# Altium schematic sheet (10)-Motor Driver-2.SchDoc
size A; SheetNumber: 11; SheetTotal: 11
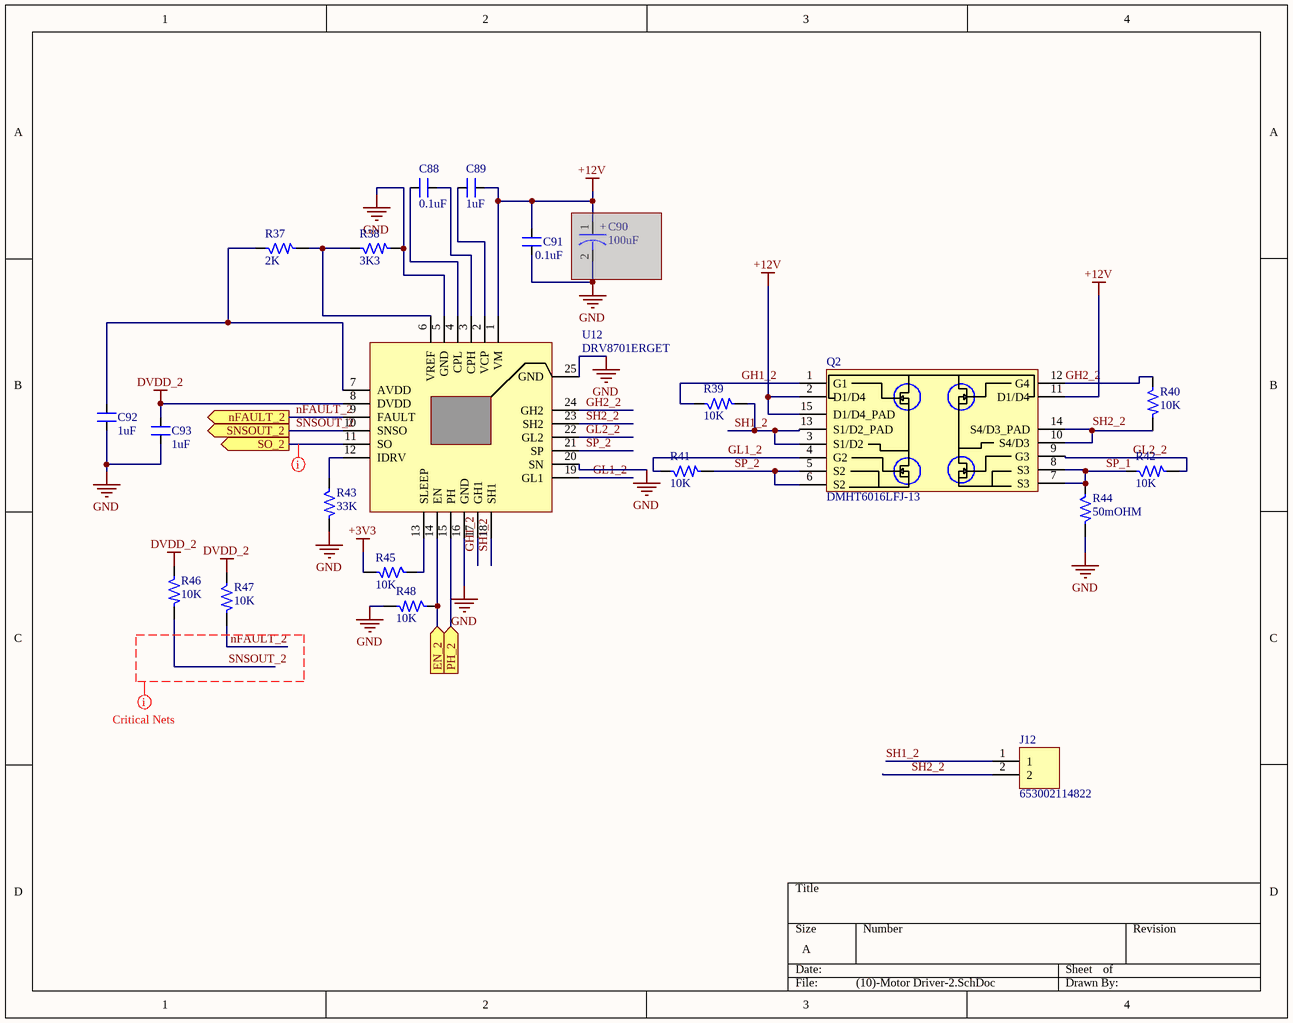
[diagram p0: (10)-Motor Driver-2.SchDoc]

## Parts
C88  0.1uF  [CAP_0805]
C89  1uF  [CAP_0805]
C90  100uF  [ACAP_P236_D305_H303_RAD]  (masked out: inside a compile mask, not in the netlist)
C91  0.1uF  [CAP_0805]
C92  1uF  [CAP_0805]
C93  1uF  [CAP_0805]
J12  653002114822  [CON2_50_653002114822_TH_ST]
Q2  DMHT6016LFJ-13  [DFN5045-12_33_212_27X15_SMD_1]
R37  2K  [RES_0603]
R38  3K3  [RES_0603]
R39  10K  [RES_0603]
R40  10K  [RES_0603]
R41  10K  [RES_0603]
R42  10K  [RES_0603]
R43  33K  [RES_0805]
R44  50mOHM  [RES_2512]
R45  10K  [RES_0603]
R46  10K  [RES_0603]
R47  10K  [RES_0603]
R48  10K  [RES_0603]
U12  DRV8701ERGET  [VFQFN24_19.6_196_12X32_SMD_1]

## Ports
EN_2 (in), nFAULT_2 (out), PH_2 (in), SNSOUT_2 (out), SO_2 (out)

## Nets
+3V3: R45.2
+12V: C89.2 C91.1 Q2.2(D1/D4) Q2.11(D1/D4) Q2.15(D1/D4_PAD) U12.1(VM)
DVDD_2: C93.1 R46.1 R47.1 U12.8(DVDD)
GND: C91.2 C92.2 C93.2 R38.2 R43.2 R44.2 R48.2 U12.5(GND) U12.16(GND) U12.20(SN) U12.25(GND)
EN_2: R48.1 U12.14(EN) ; port EN_2
GH1_2: Q2.1(G1) R39.1 U12.17(GH1)
GH2_2: Q2.12(G4) R40.1 U12.24(GH2)
GL1_2: Q2.4(G2) R41.1 U12.19(GL1)
GL2_2: Q2.9(G3) R42.2 U12.22(GL2)
nFAULT_2: R47.2 U12.9(FAULT) ; port nFAULT_2
PH_2: U12.15(PH) ; port PH_2
SH1_2: J12.1 Q2.3(S1/D2) Q2.13(S1/D2_PAD) R39.2 U12.18(SH1)
SH2_2: J12.2 Q2.10(S4/D3) Q2.14(S4/D3_PAD) R40.2 U12.23(SH2)
SNSOUT_2: R46.2 U12.10(SNSO) ; port SNSOUT_2
SO_2: U12.11(SO) ; port SO_2
SP_1: Q2.7(S3) Q2.8(S3) R42.1 R44.1
SP_2: Q2.5(S2) Q2.6(S2) R41.2 U12.21(SP)
NetC88_1: C88.1 U12.3(CPH)
NetC88_2: C88.2 U12.4(CPL)
NetC89_1: C89.1 U12.2(VCP)
NetC92_1: C92.1 R37.1 U12.7(AVDD)
NetR37_2: R37.2 R38.1 U12.6(VREF)
NetR43_1: R43.1 U12.12(IDRV)
NetR45_1: R45.1 U12.13(SLEEP)

## Layout directives
net class Critical Nets: nFAULT_2, SNSOUT_2, SO_2

## Notes on the sheet
- (in symbol CAP-P_100uF-25V-20%-RAD) +

## Library data of the parts
C88 C91 = CAP_0.1uF-50V-10%-0805: 0.1µF ±10% 50V Ceramic Capacitor X7R 0805 (2012 Metric); Manufacturer: Samsung; Manufacturer Part Number: CL21B104KBCNNNC; Alternate Part Number-1: NA; Case/Package: 0805; Supplier-1: SIRICOM; Supplier Part Number-1: 0805B104K500CT
C89 C92 C93 = CAP_1uF-50V-5%-0805: 1µF ±5% 50V Ceramic Capacitor X7R 0805 (2012 Metric); Manufacturer: Samsung; Manufacturer Part Number: CC0805JKX7R9BB105; Alternate Part Number-1: 0805F105M500NT; Case/Package: 0805; Supplier-1: SIRICOM; Supplier Part Number-1: CL21B105KBFNNNE
C90 = CAP-P_100uF-25V-20%-RAD: 100µF 25V Aluminum Electrolytic Capacitors Radial, Can - SMD 1000 Hrs @ 105°C; Manufacturer: Nichicon; Manufacturer Part Number: UWT1E101MCL1GS; Alternate Part Number-1: NA; Case/Package: Radial-SMD; Supplier-1: SP ROAD; Supplier Part Number-1: UWT1E101MCL1GS
J12 = CON-PLG_2X1-50-ST-TH: 2 Pins, 1 Row 1.25mm Pitch, Straight Connector, male; Manufacturer: JST; Mating Part Number: 653002113322; Crimp Part Number: 653153128130; Alternate Part Number-1: NA; Manufacturer Part Number: 653002114822; Case/Package: TH-CON; Supplier-1: WURTH; Supplier Part Number-1: 653002114822
Q2 = MOSFET-N_60V-14.8A-V-DFN5045-12: Mosfet Array 4 N-Channel 14.8A (Ta) Surface Mount V-DFN5045-12; Manufacturer: ON Semiconductor; Alternate Part Number-1: DMHT3006LFJ-13; Manufacturer Part Number: DMHT6016LFJ-13; Case/Package: DFN5045-12; Supplier-1: LCSC; Supplier Part Number-1: C460986
R37 = RES_2K-0.125W-1%-0603: 2 kOhms ±1% 0.125W, 1/8W Chip Resistor 0603 (1608 Metric) Anti-Sulfur, Moisture Resistant Thin Film; Manufacturer: Stackpole Electronics; Manufacturer Part Number: RNCP0603FTD2K00; Alternate Part Number-1: NA; Case/Package: 0603; Supplier-1: SIRICOM; Supplier Part Number-1: WR06X2001FTL
R38 = RES_3.3K-0.1W-1%-0603: 3.3 kOhms ±1% 0.1W, 1/10W Chip Resistor 0603 (1608 Metric) Automotive AEC-Q200 Thick Film; Manufacturer: Wilson; Manufacturer Part Number: WR06X3301FTL; Alternate Part Number-1: 0603WAF3301T5E; Case/Package: 0603; Supplier-1: SIRICOM; Supplier Part Number-1: WR06X3301FTL
R39-R42 R45-R48 = RES_10K-0.1W-1%-0603: 10 kOhms ±1% 0.1W, 1/10W Chip Resistor 0603 (1608 Metric) Automotive AEC-Q200 Thick Film; Manufacturer: Walsin; Manufacturer Part Number: WR06X1002FTL; Alternate Part Number-1: 0603WAJ0103T5E; Case/Package: 0603; Supplier-1: SIRICOM; Supplier Part Number-1: WR06X1002FTL
R43 = RES_33K-0.125W-1%-0805: Thick Film Resistors - SMD 33KOhms 1/8W 150V33 kOhms ±1% 0.125W, 1/8W Chip Resistor 0805 (2012 Metric) Thick Film; Manufacturer: Vishay BCcomponents; Manufacturer Part Number: CRG0805F33K; Alternate Part Number-1: NA; Case/Package: 0805; Supplier-1: SIRICOM; Supplier Part Number-1: WR08X3302FTL
R44 = RES_50mOhm-2W-1%-2512: 50 mOhms ±1% 2W Chip Resistor 2512 (6432 Metric) Automotive AEC-Q200, Current Sense, Moisture Resistant Metal Element; Manufacturer: Yageo; Manufacturer Part Number: PA2512FKF7W0R05E; Alternate Part Number-1: PMR100HZPFU5L00; Case/Package: 2512; Supplier-1: SIRICOM; Supplier Part Number-1: LR2512-22R060F1
U12 = IC_DRV8701ERGET: Motor Driver Power MOSFET Parallel 24-VQFN (4x4); Manufacturer: Texas Instruments; Alternate Part Number-1: NA; Manufacturer Part Number: DRV8701ERGET; Case/Package: VFQFN24; Supplier-1: ARROW; Supplier Part Number-1: DRV8701ERGET